# EAGLE design WeWyAn (EAGLE 9.0.1)
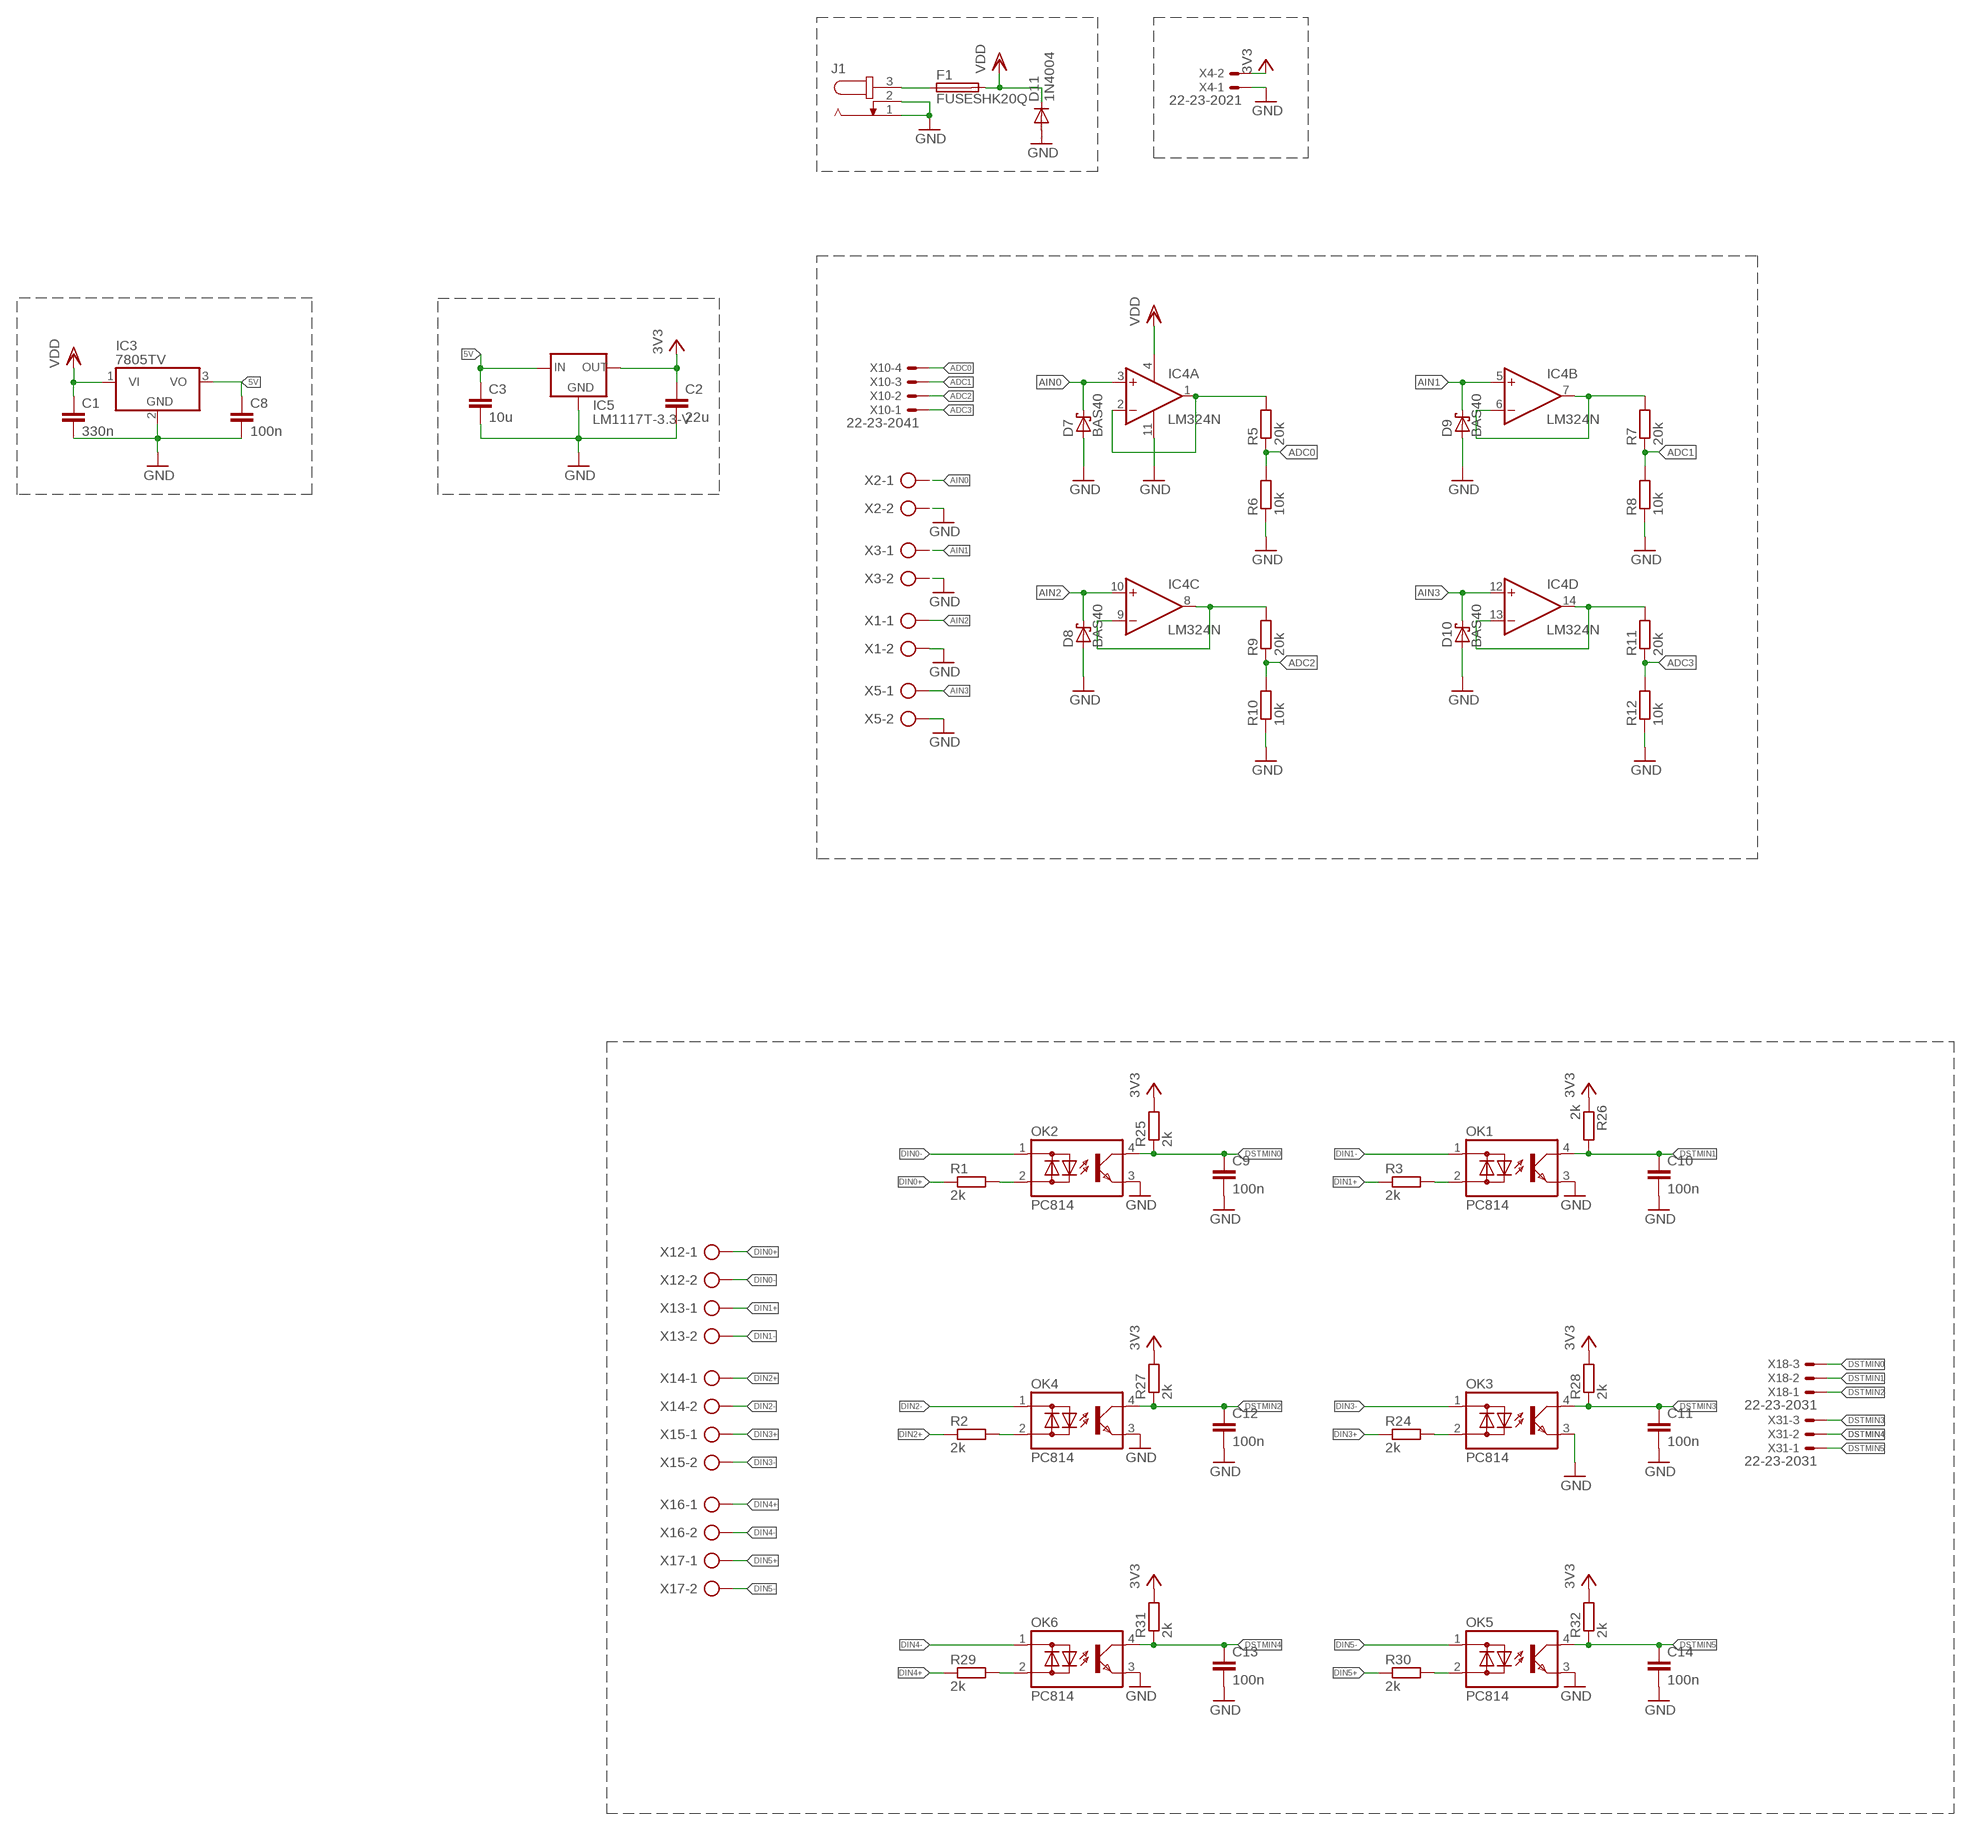
[diagram p0: schematic, sheet 1, part 1 of 2]
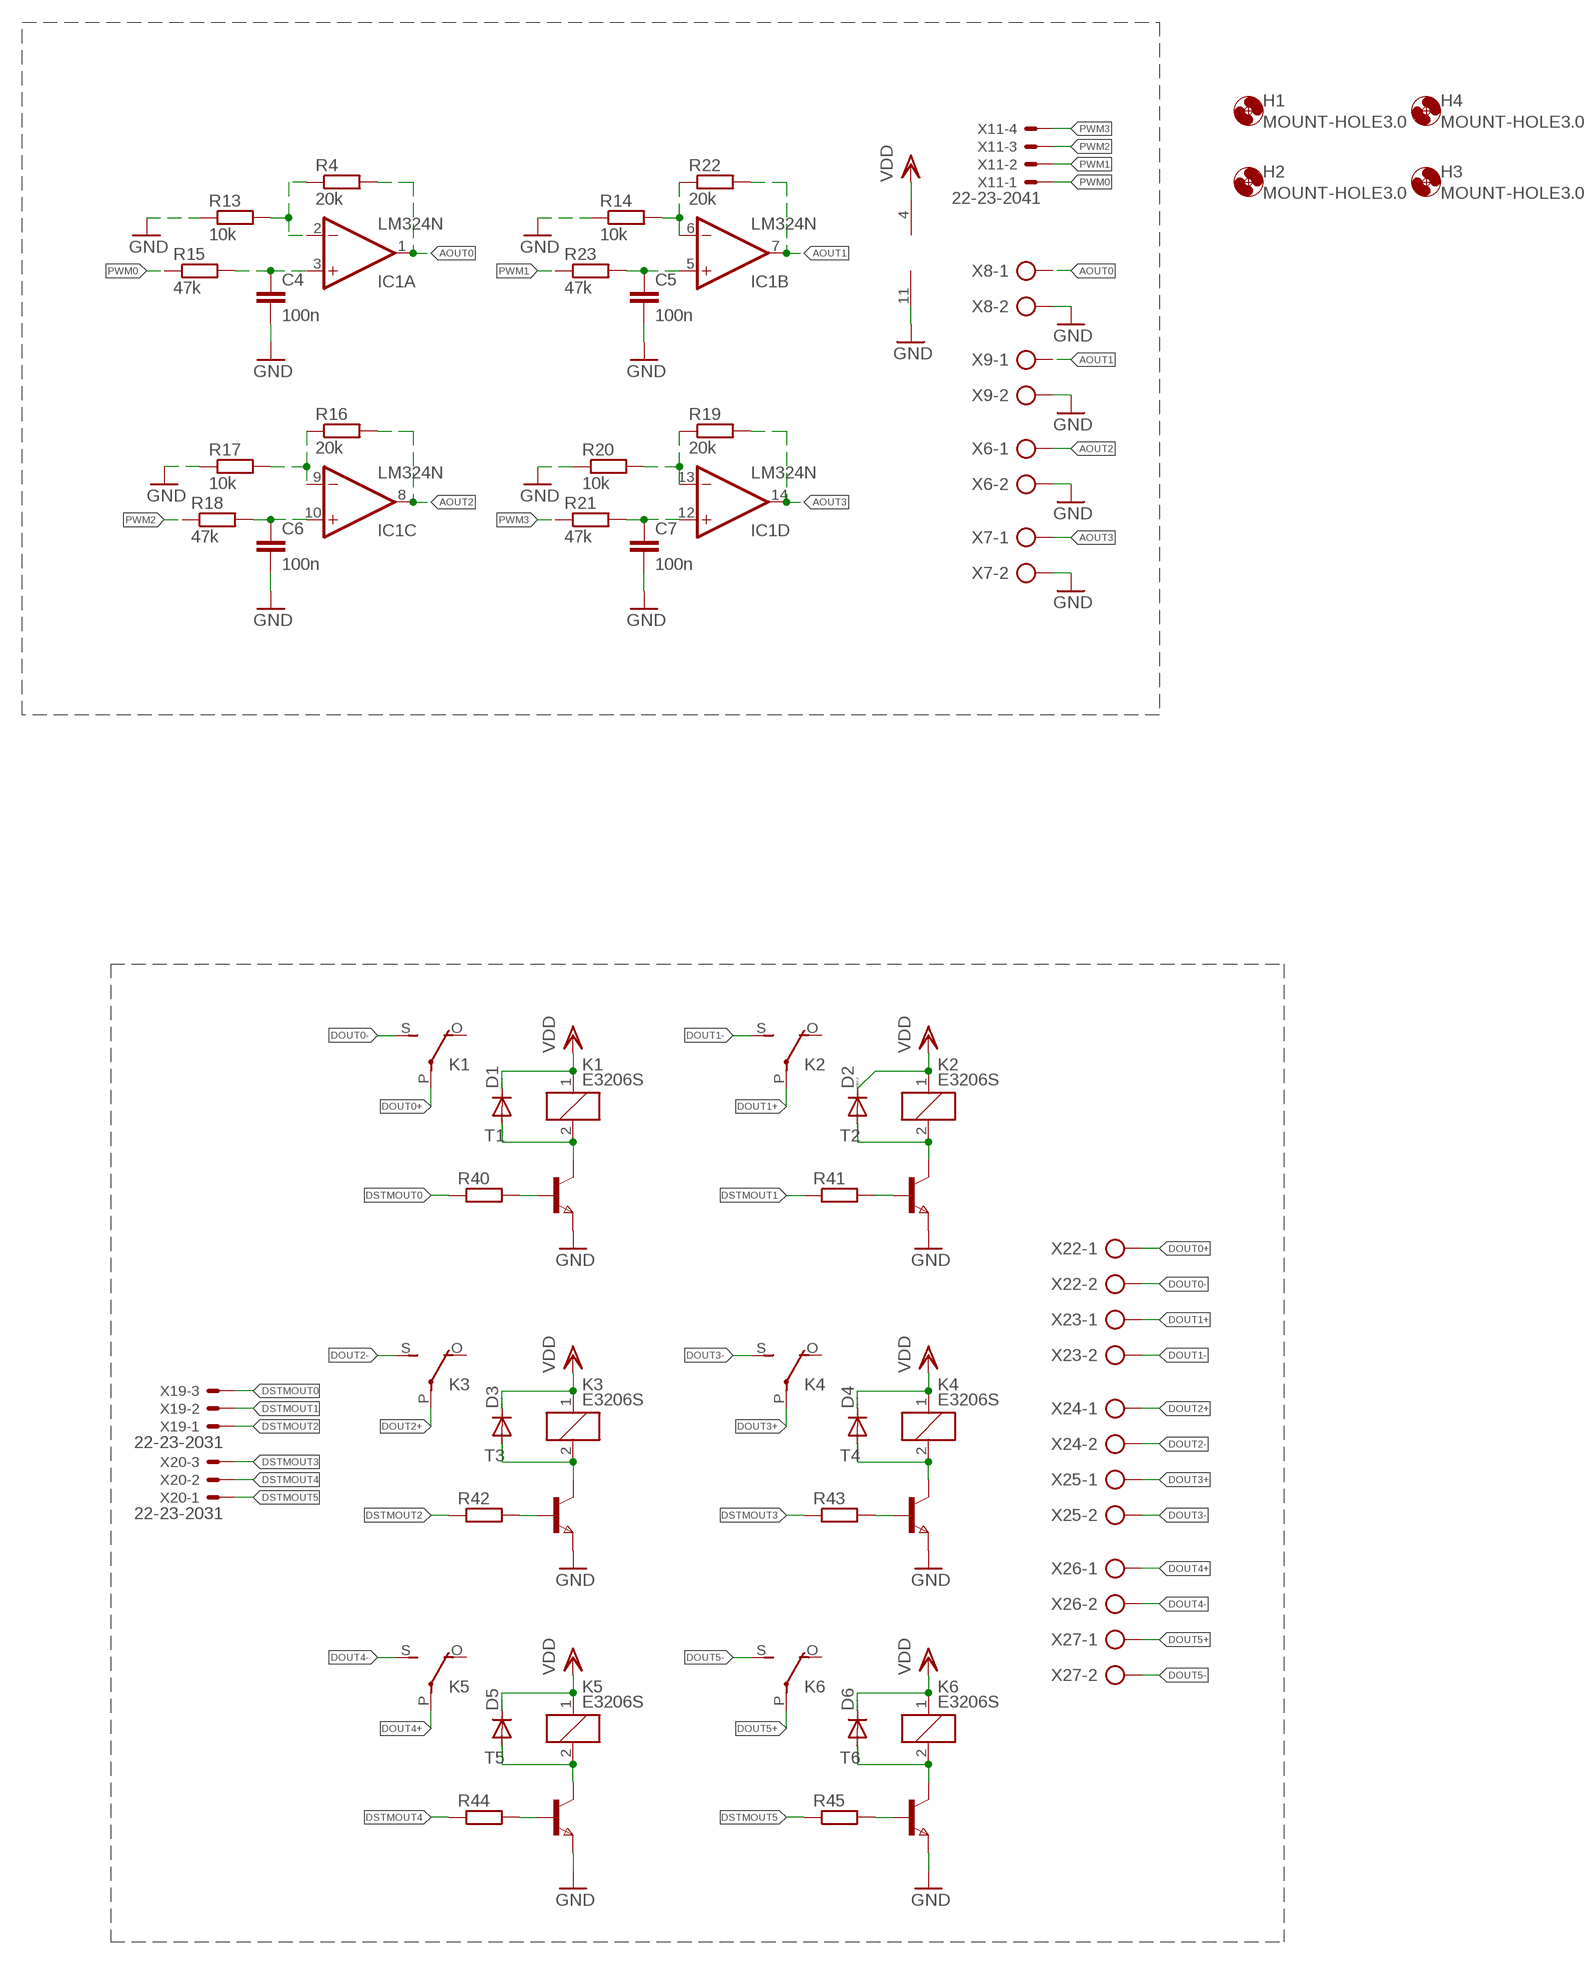
[diagram p1: schematic, sheet 1, part 2 of 2]

## Parts
C1  330n  C-EUC0603  [C0603]
C2  22u  C-EUC0603K  [C0603K]
C3  10u  C-EUC0603K  [C0603K]
C4  100n  C-EUC0603K  [C0603K]
C5  100n  C-EUC0603K  [C0603K]
C6  100n  C-EUC0603K  [C0603K]
C7  100n  C-EUC0603K  [C0603K]
C8  100n  C-EUC0603  [C0603]
C9  100n  C-EUC0603  [C0603]
C10  100n  C-EUC0603  [C0603]
C11  100n  C-EUC0603  [C0603]
C12  100n  C-EUC0603  [C0603]
C13  100n  C-EUC0603  [C0603]
C14  100n  C-EUC0603  [C0603]
D1  DIODE-DO214AC  [DO214AC]
D2  DIODE-DO214AC  [DO214AC]
D3  DIODE-DO214AC  [DO214AC]
D4  DIODE-DO214AC  [DO214AC]
D5  DIODE-DO214AC  [DO214AC]
D6  DIODE-DO214AC  [DO214AC]
D7  BAS40  [SOT23]
D8  BAS40  [SOT23]
D9  BAS40  [SOT23]
D10  BAS40  [SOT23]
D11  1N4004  [DO41-10]
F1  FUSESHK20Q  [SHK20Q]
H1  MOUNT-HOLE3.0  [3,0]
H2  MOUNT-HOLE3.0  [3,0]
H3  MOUNT-HOLE3.0  [3,0]
H4  MOUNT-HOLE3.0  [3,0]
IC1  LM324N  [DIL14]
IC3  7805TV  [TO220V]
IC4  LM324N  [DIL14]
IC5  LM1117T-3.3-V  [TO220V]
J1  JACK-PLUG1  [SPC4078]
K1  E3206S  [E3206S]
K2  E3206S  [E3206S]
K3  E3206S  [E3206S]
K4  E3206S  [E3206S]
K5  E3206S  [E3206S]
K6  E3206S  [E3206S]
OK1  PC814  [DIL04]
OK2  PC814  [DIL04]
OK3  PC814  [DIL04]
OK4  PC814  [DIL04]
OK5  PC814  [DIL04]
OK6  PC814  [DIL04]
R1  2k  R-EU_R0603  [R0603]
R2  2k  R-EU_R0603  [R0603]
R3  2k  R-EU_R0603  [R0603]
R4  20k  R-EU_R0603  [R0603]
R5  20k  R-EU_R0603  [R0603]
R6  10k  R-EU_R0603  [R0603]
R7  20k  R-EU_R0603  [R0603]
R8  10k  R-EU_R0603  [R0603]
R9  20k  R-EU_R0603  [R0603]
R10  10k  R-EU_R0603  [R0603]
R11  20k  R-EU_R0603  [R0603]
R12  10k  R-EU_R0603  [R0603]
R13  10k  R-EU_R0603  [R0603]
R14  10k  R-EU_R0603  [R0603]
R15  47k  R-EU_R0603  [R0603]
R16  20k  R-EU_R0603  [R0603]
R17  10k  R-EU_R0603  [R0603]
R18  47k  R-EU_R0603  [R0603]
R19  20k  R-EU_R0603  [R0603]
R20  10k  R-EU_R0603  [R0603]
R21  47k  R-EU_R0603  [R0603]
R22  20k  R-EU_R0603  [R0603]
R23  47k  R-EU_R0603  [R0603]
R24  2k  R-EU_R0603  [R0603]
R25  2k  R-EU_R0603  [R0603]
R26  2k  R-EU_R0603  [R0603]
R27  2k  R-EU_R0603  [R0603]
R28  2k  R-EU_R0603  [R0603]
R29  2k  R-EU_R0603  [R0603]
R30  2k  R-EU_R0603  [R0603]
R31  2k  R-EU_R0603  [R0603]
R32  2k  R-EU_R0603  [R0603]
R40  R-EU_R0603  [R0603]
R41  R-EU_R0603  [R0603]
R42  R-EU_R0603  [R0603]
R43  R-EU_R0603  [R0603]
R44  R-EU_R0603  [R0603]
R45  R-EU_R0603  [R0603]
T1  NPNSOT223  [SOT223]
T2  NPNSOT223  [SOT223]
T3  NPNSOT223  [SOT223]
T4  NPNSOT223  [SOT223]
T5  NPNSOT223  [SOT223]
T6  NPNSOT223  [SOT223]
X1  AK500/2-H  [AK500/2-H]
X2  AK500/2-H  [AK500/2-H]
X3  AK500/2-H  [AK500/2-H]
X4  22-23-2021  [22-23-2021]
X5  AK500/2-H  [AK500/2-H]
X6  AK500/2-H  [AK500/2-H]
X7  AK500/2-H  [AK500/2-H]
X8  AK500/2-H  [AK500/2-H]
X9  AK500/2-H  [AK500/2-H]
X10  22-23-2041  [22-23-2041]
X11  22-23-2041  [22-23-2041]
X12  AK500/2-H  [AK500/2-H]
X13  AK500/2-H  [AK500/2-H]
X14  AK500/2-H  [AK500/2-H]
X15  AK500/2-H  [AK500/2-H]
X16  AK500/2-H  [AK500/2-H]
X17  AK500/2-H  [AK500/2-H]
X18  22-23-2031  [22-23-2031]
X19  22-23-2031  [22-23-2031]
X20  22-23-2031  [22-23-2031]
X22  AK500/2-H  [AK500/2-H]
X23  AK500/2-H  [AK500/2-H]
X24  AK500/2-H  [AK500/2-H]
X25  AK500/2-H  [AK500/2-H]
X26  AK500/2-H  [AK500/2-H]
X27  AK500/2-H  [AK500/2-H]
X31  22-23-2031  [22-23-2031]

## Nets
5V: C3.1 C8.1 IC3.3(VO) IC5.3(IN)
ADC0: R5.1 R6.2 X10.4
ADC1: R7.1 R8.2 X10.3
ADC2: R9.1 R10.2 X10.2
ADC3: R11.1 R12.2 X10.1
AIN0: D7.3(C) IC4.3(A:+IN) X2.1
AIN1: D9.3(C) IC4.5(B:+IN) X3.1
AIN2: D8.3(C) IC4.10(C:+IN) X1.1
AIN3: D10.3(C) IC4.12(D:+IN) X5.1
AOUT0: IC1.1(A:OUT) R4.2 X8.1
AOUT1: IC1.7(B:OUT) R22.2 X9.1
AOUT2: IC1.8(C:OUT) R16.2 X6.1
AOUT3: IC1.14(D:OUT) R19.2 X7.1
DIN0+: R1.1 X12.1
DIN0-: OK2.1(AC1) X12.2
DIN1+: R3.1 X13.1
DIN1-: OK1.1(AC1) X13.2
DIN2+: R2.1 X14.1
DIN2-: OK4.1(AC1) X14.2
DIN3+: R24.1 X15.1
DIN3-: OK3.1(AC1) X15.2
DIN4+: R29.1 X16.1
DIN4-: OK6.1(AC1) X16.2
DIN5+: R30.1 X17.1
DIN5-: OK5.1(AC1) X17.2
DOUT0+: K1.P(2:P) X22.1
DOUT0-: K1.S(2:S) X22.2
DOUT1+: K2.P(2:P) X23.1
DOUT1-: K2.S(2:S) X23.2
DOUT2+: K3.P(2:P) X24.1
DOUT2-: K3.S(2:S) X24.2
DOUT3+: K4.P(2:P) X25.1
DOUT3-: K4.S(2:S) X25.2
DOUT4+: K5.P(2:P) X26.1
DOUT4-: K5.S(2:S) X26.2
DOUT5+: K6.P(2:P) X27.1
DOUT5-: K6.S(2:S) X27.2
DSTMIN0: C9.1 OK2.4(C) R25.1 X18.3
DSTMIN1: C10.1 OK1.4(C) R26.2 X18.2
DSTMIN2: C12.1 OK4.4(C) R27.1 X18.1
DSTMIN3: C11.1 OK3.4(C) R28.1 X31.3
DSTMIN4: C13.1 OK6.4(C) R31.1 X31.2
DSTMIN5: C14.1 OK5.4(C) R32.1 X31.1
DSTMOUT0: R40.1 X19.3
DSTMOUT1: R41.1 X19.2
DSTMOUT2: R42.1 X19.1
DSTMOUT3: R43.1 X20.3
DSTMOUT4: R44.1 X20.2
DSTMOUT5: R45.1 X20.1
GND: C1.2 C2.2 C3.2 C4.2 C5.2 C6.2 C7.2 C8.2 C9.2 C10.2 C11.2 C12.2 C13.2 C14.2 D7.1(A) D8.1(A) D9.1(A) D10.1(A) D11.A IC1.11(P:V-) IC3.2(GND) IC4.11(P:V-) IC5.1(GND) J1.1 J1.2 OK1.3(E) OK2.3(E) OK3.3(E) OK4.3(E) OK5.3(E) OK6.3(E) R6.1 R8.1 R10.1 R12.1 R13.1 R14.1 R17.1 R20.1 T1.3(E) T2.3(E) T3.3(E) T4.3(E) T5.3(E) T6.3(E) X1.2 X2.2 X3.2 X4.1 X5.2 X6.2 X7.2 X8.2 X9.2
MINUS0: IC4.1(A:OUT) IC4.2(A:-IN) R5.2
MINUS1: IC4.6(B:-IN) IC4.7(B:OUT) R7.2
MINUS2: IC4.8(C:OUT) IC4.9(C:-IN) R9.2
MINUS3: IC4.13(D:-IN) IC4.14(D:OUT) R11.2
N$1: IC1.2(A:-IN) R4.1 R13.2
N$2: OK2.2(AC2) R1.2
N$3: C4.1 IC1.3(A:+IN) R15.2
N$4: C6.1 IC1.10(C:+IN) R18.2
N$5: OK1.2(AC2) R3.2
N$6: IC1.9(C:-IN) R16.1 R17.2
N$7: IC1.13(D:-IN) R19.1 R20.2
N$8: IC1.6(B:-IN) R14.2 R22.1
N$9: OK3.2(AC2) R24.2
N$10: OK4.2(AC2) R2.2
N$11: C7.1 IC1.12(D:+IN) R21.2
N$12: F1.1A J1.3
N$15: C5.1 IC1.5(B:+IN) R23.2
N$17: OK5.2(AC2) R30.2
N$18: OK6.2(AC2) R29.2
N$21: R40.2 T1.1(B)
N$22: D1.A K1.2 T1.2(C) T1.4(C)
N$23: R41.2 T2.1(B)
N$24: R43.2 T4.1(B)
N$25: D2.A K2.2 T2.2(C) T2.4(C)
N$26: R42.2 T3.1(B)
N$27: D3.A K3.2 T3.2(C) T3.4(C)
N$28: R44.2 T5.1(B)
N$29: D4.A K4.2 T4.2(C) T4.4(C)
N$30: R45.2 T6.1(B)
N$31: D5.A K5.2 T5.2(C) T5.4(C)
N$32: D6.A K6.2 T6.2(C) T6.4(C)
PWM0: R15.1 X11.1
PWM1: R23.1 X11.2
PWM2: R18.1 X11.3
PWM3: R21.1 X11.4
VCC: C2.1 IC5.2(OUT) R25.2 R26.1 R27.2 R28.2 R31.2 R32.2 X4.2 ; supply symbol labelled 3V3
VDD: C1.1 D1.C D2.C D3.C D4.C D5.C D6.C D11.C F1.2A IC1.4(P:V+) IC3.1(VI) IC4.4(P:V+) K1.1 K2.1 K3.1 K4.1 K5.1 K6.1
Unconnected: K1.O(2:O) K2.O(2:O) K3.O(2:O) K4.O(2:O) K5.O(2:O) K6.O(2:O)

## Library data of the parts
C1 C8-C14 = rcl:C-EU: CAPACITOR, European symbol; SPICEPREFIX: C
C2-C7 = rcl:C-EU: CAPACITOR, European symbol
D1-D6 = diode:DIODE-: DIODE
D7-D10 = diode:BAS40: Silicon Schottky Diodes General-purpose diode for high-speed switching
D11 = diode:1N4004: DIODE general purpose rectifier, 1 A
F1 = fuse:FUSE: Fuse; OC_FARNELL: unknown; OC_NEWARK: unknown
H1-H4 = holes:MOUNT-HOLE: MOUNTING HOLE with drill center marker
IC1 IC4 = linear:LM324: OP AMP
IC3 = linear:78*: Positive VOLTAGE REGULATOR Source: http://cache.national.com/ds/LM/LM78L05.pdf http://www.fairchildsemi.com/ds/LM/LM7805.pdf
IC5 = lm1117:LM1117T-*
J1 = con-jack:JACK-PLUG: DC POWER JACK Power Jack, DC, Right Angle, Through Hole, Rated 5A at 16VDC, PC Terminals Distributor: Farnell (www.Farnell.de) Drawing: 84N1161.pdf / 84N1162.pdf Manufacturer: SPC Technology (www.spctechnology.com) Type: SPC4077 / SPC 4078; OC_FARNELL: unknown; OC_NEWARK: unknown
K1-K6 = relay:E3206S: RELAY 1 x switch, Eichhoff/distributor Schukat; OC_FARNELL: unknown; OC_NEWARK: unknown
OK1-OK6 = optocoupler:PC814: SHARP OPTO COUPLER; OC_FARNELL: 9707662; OC_NEWARK: unknown
R1-R32 = rcl:R-EU_: RESISTOR, European symbol
R40-R45 = rcl:R-EU_: RESISTOR, European symbol; SPICEPREFIX: R
T1-T6 = zetex:NPNSOT223: NPN TRANSISTOR; MPN: DJT4031N-13; OC_FARNELL: 1710672; OC_NEWARK: 25R4490
X1-X3 X5-X9 X12-X17 X22-X27 = con-ptr500:AK500/2-H: CONNECTOR Aug. 2004 / PTR Meßtechnik: Die Bezeichnung der Serie AK505 wurde geändert. Es handelt sich hierbei um AK500 in horizontaler Ausführung.; OC_FARNELL: unknown; OC_NEWARK: unknown
X4 = con-molex:22-23-2021: .100" (2.54mm) Center Header - 2 Pin; MF: MOLEX; MPN: 22-23-2021; OC_FARNELL: 1462926; OC_NEWARK: 25C3832
X10 X11 = con-molex:22-23-2041: .100" (2.54mm) Center Header - 4 Pin; MF: MOLEX; MPN: 22-23-2041; OC_FARNELL: 1462920; OC_NEWARK: 38C0355
X18-X20 X31 = con-molex:22-23-2031: .100" (2.54mm) Center Header - 3 Pin; MF: MOLEX; MPN: 22-23-2031; OC_FARNELL: 1462950; OC_NEWARK: 30C0862

## Board
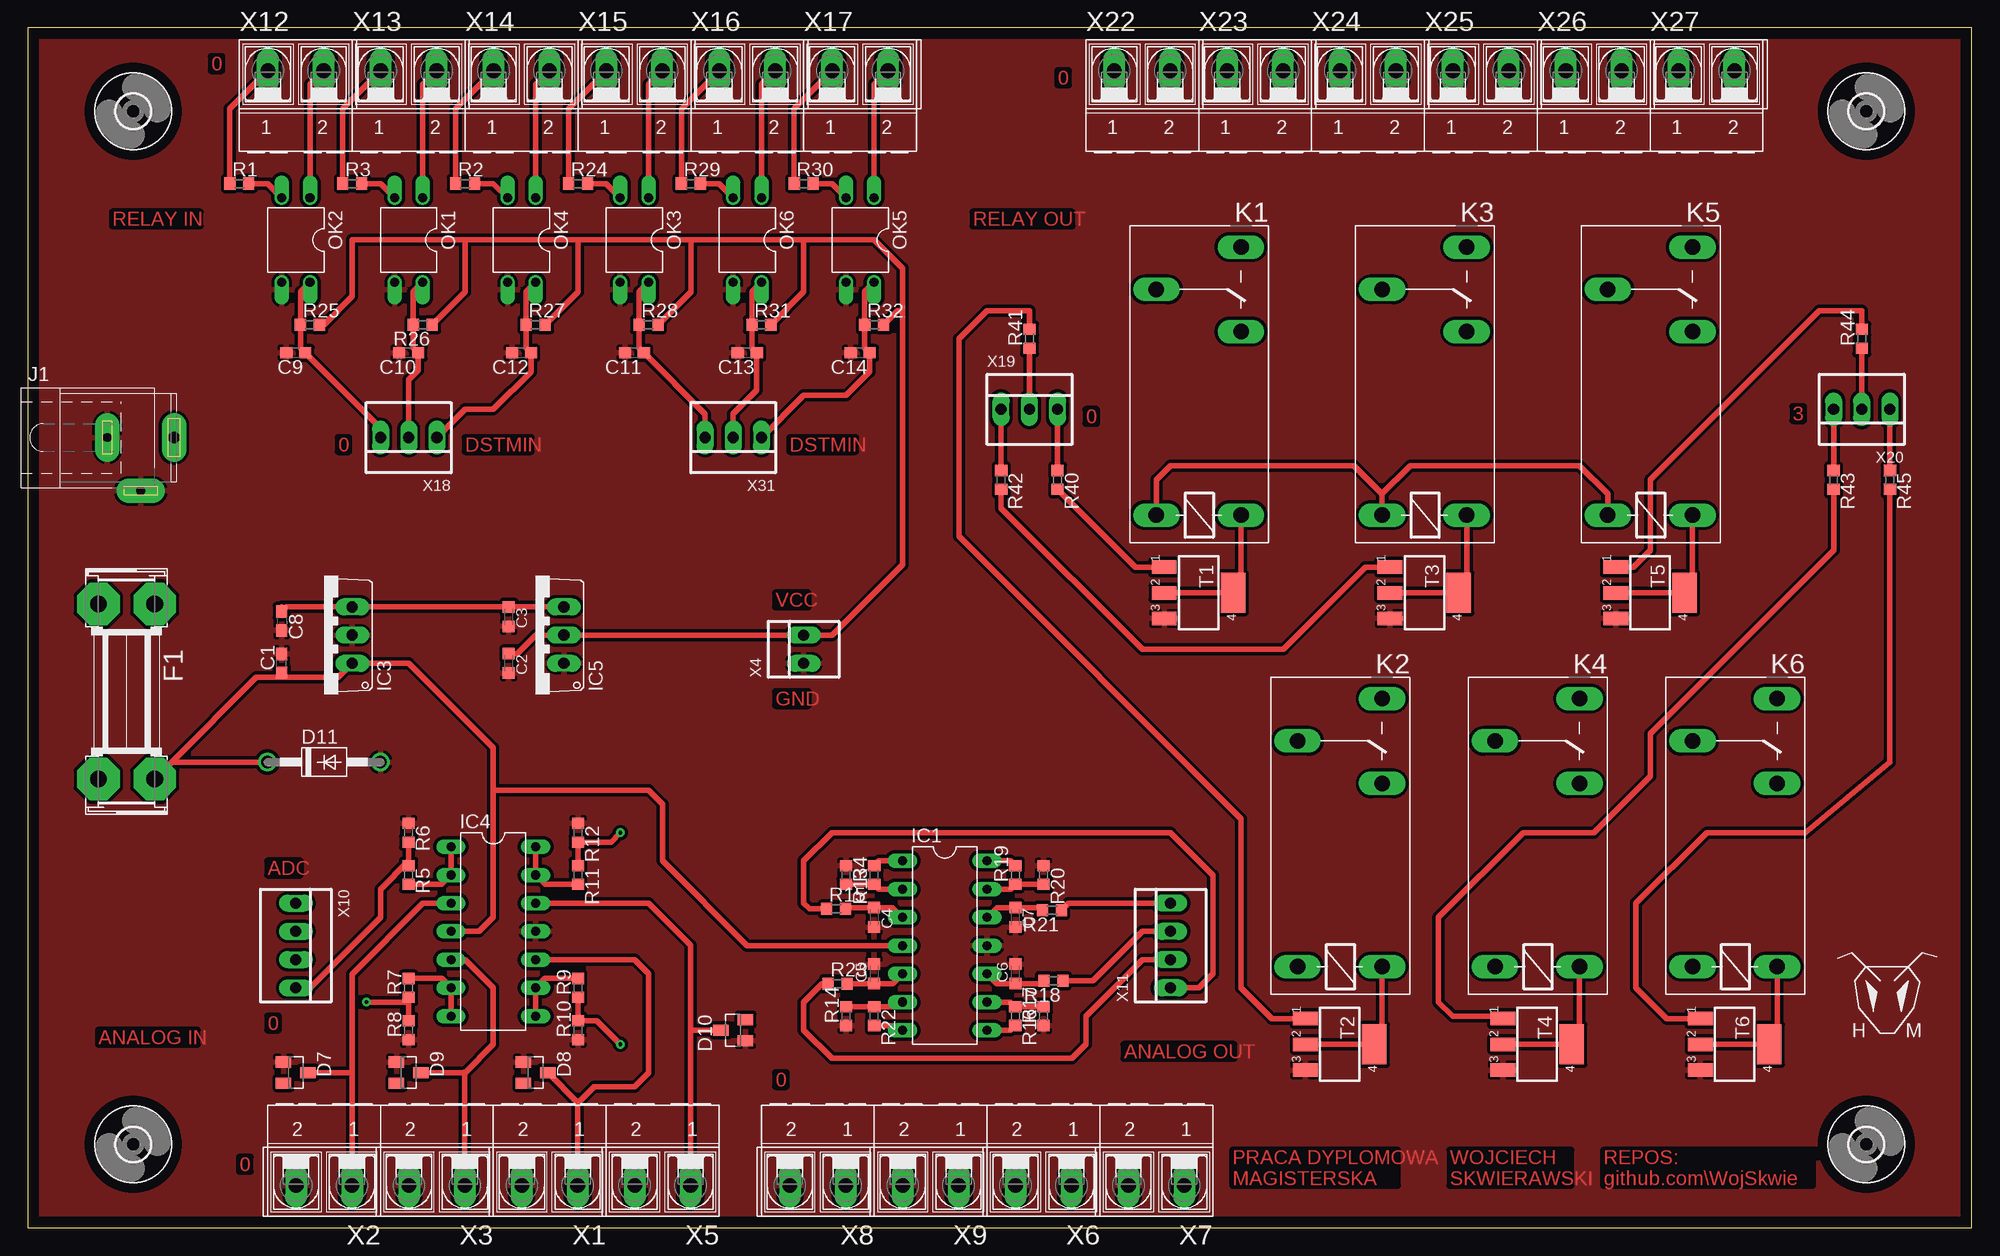
[diagram p2: board, top side]
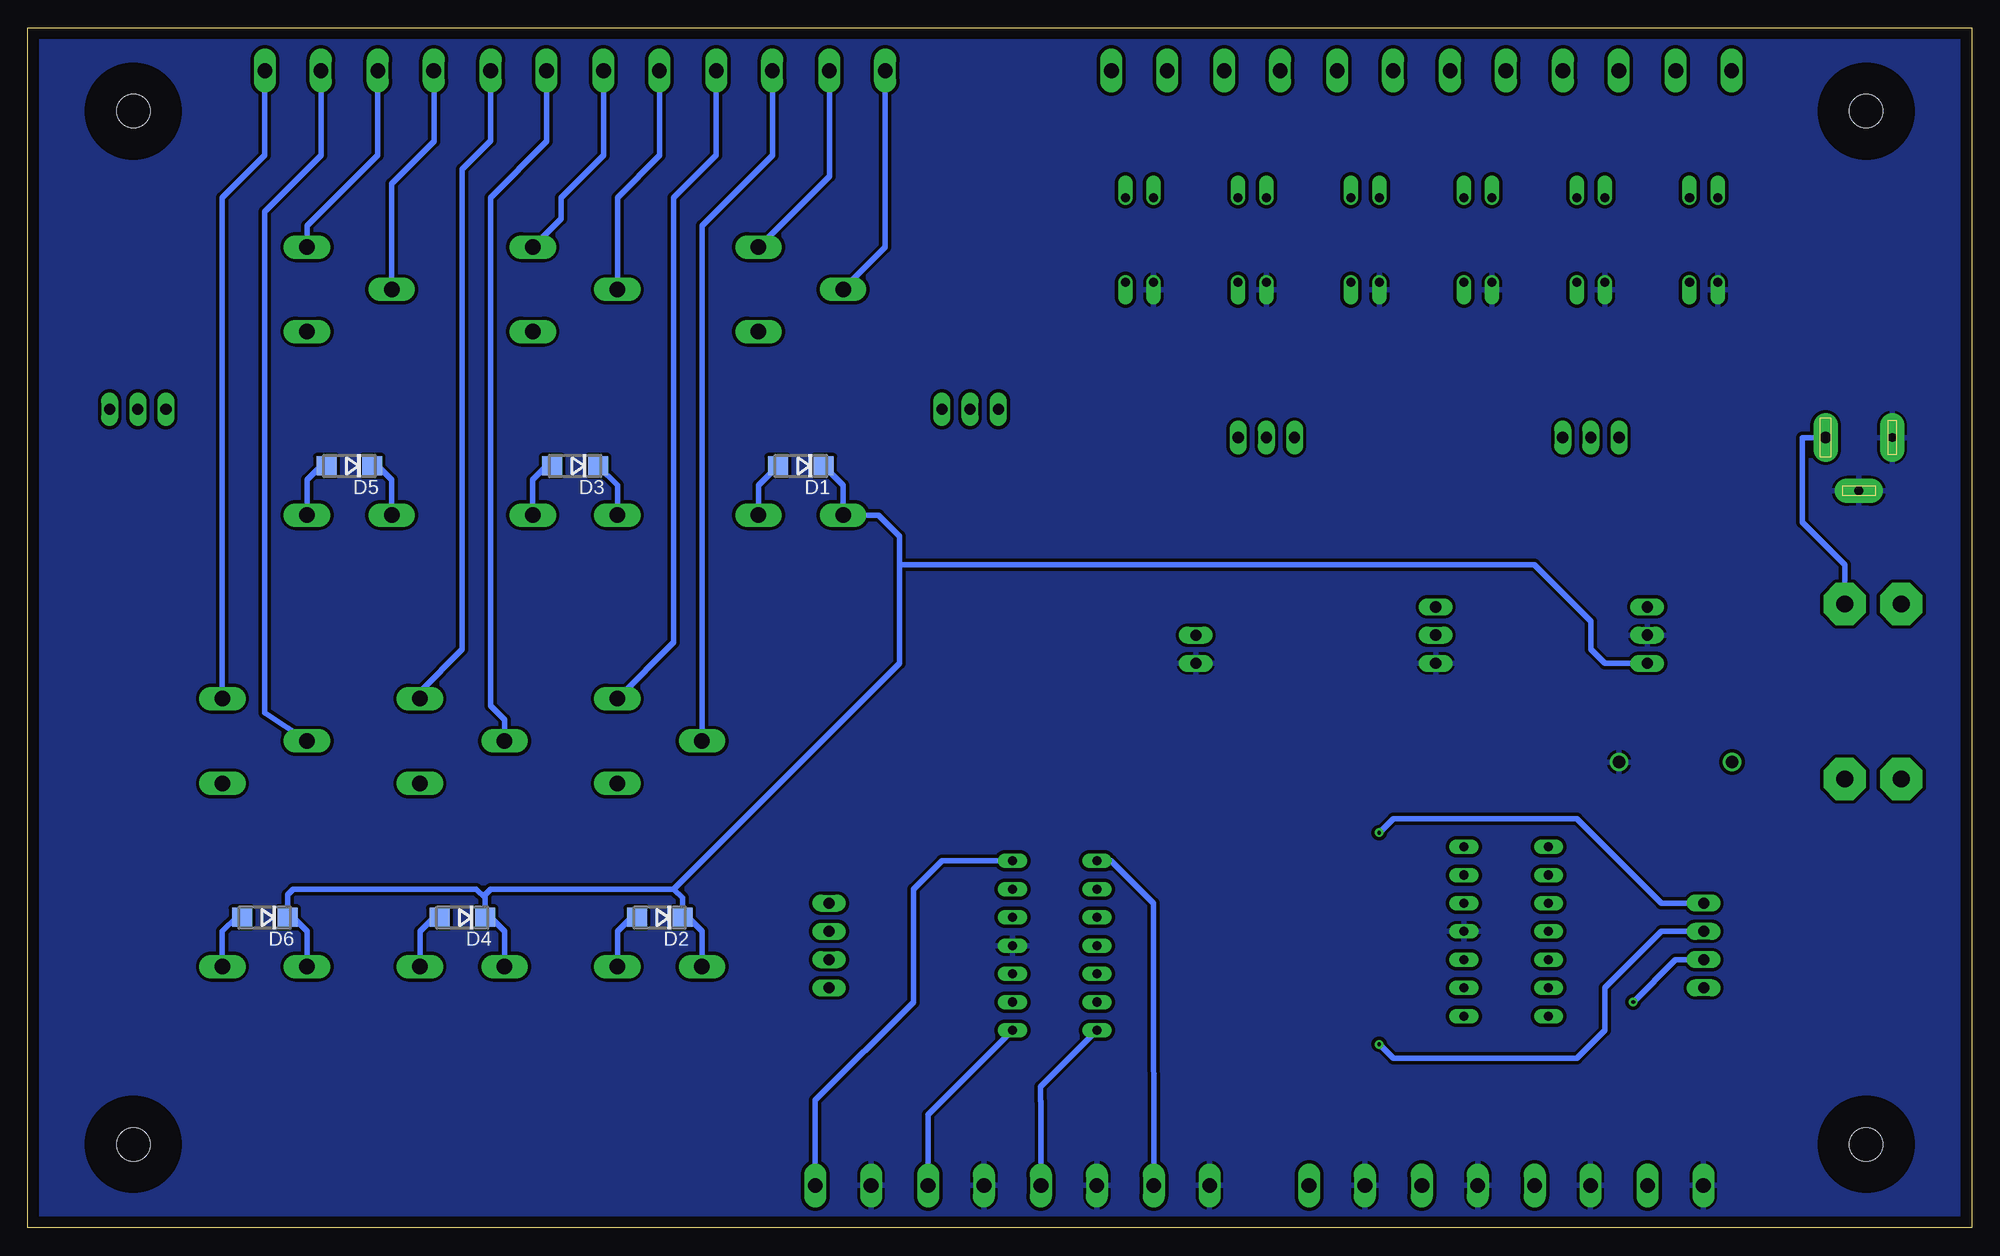
[diagram p3: board, bottom side, seen from below]

Size 175 x 108 mm. Coordinates in mm from the lower left corner, seen from the top.
Outline: 0,0 175,0 175,108 0,108 0,0
Copper layers (1*16): Top 0.035mm / dielectric 1.5mm / Bottom 0.035mm
Design rules "default": minimum track width 6mil, minimum drill 0.35mm, track to track 6mil, track to pad 6mil, pad to pad 6mil, via to via 6mil, smd to smd 6mil, copper to edge 40mil, drill to drill 6mil, minimum pad ring 10mil, minimum via ring 8mil, stop-mask expansion 4mil, vias tented up to drill 0mil, thermal gap 10mil

### Footprints (pad centres in the part's own frame; a part is rotated, then mirrored left to right if it is on the bottom)
C0603 = smd 1.1 x 1: 1 -0.85,0; 2 0.85,0
C0603K = smd 1.05 x 1.08: 1 -0.875,0; 2 0.875,0
DO214AC = smd 1.8 x 1.7: A 2.05,0; C -2.05,0
SOT23 = smd 1 x 1.4: 1 -0.95,-1.1; 2 0.95,-1.1; 3 0,1.1
DO41-10 = drill 1.118: A 5.08,0; C -5.08,0
SHK20Q = drill 1.5 pad 3.81 octagon: 1A -7.874,2.54; 1B -7.874,-2.54; 2A 7.874,2.54; 2B 7.874,-2.54
3,0 = hole 3: 0,0
DIL14 = drill 0.813 long: 1 -7.62,-3.81; 2 -5.08,-3.81; 3 -2.54,-3.81; 4 0,-3.81; 5 2.54,-3.81; 6 5.08,-3.81; 7 7.62,-3.81; 8 7.62,3.81; 9 5.08,3.81; 10 2.54,3.81; 11 0,3.81; 12 -2.54,3.81; 13 -5.08,3.81; 14 -7.62,3.81
TO220V = drill 1.016 long: 1 -2.54,-2.54; 2 0,-2.54; 3 2.54,-2.54
SPC4078 = drill 0.8 pad 2.184 long: 1 -3,0; 2 0,-4.8 | drill 1 pad 2.184 long: 3 3,0
E3206S = drill 1.397 long: 1 -3.175,3.81; 2 -3.175,-3.81; O 13.335,-3.81; P 17.145,3.81; S 20.955,-3.81
DIL04 = drill 0.813 offset: 1 -1.27,-3.81; 2 1.27,-3.81; 3 1.27,3.81; 4 -1.27,3.81
R0603 = smd 1 x 1.1: 1 -0.85,0; 2 0.85,0
SOT223 = smd 1.219 x 2.235: 1 -2.311,-3.099; 2 0,-3.099; 3 2.311,-3.099 | smd 3.6 x 2.2: 4 0,3.099
AK500/2-H = drill 1.321 long: 1 -2.515,0; 2 2.515,0
22-23-2021 = drill 1 long: 1 -1.27,0; 2 1.27,0
22-23-2041 = drill 1 long: 1 -3.81,0; 2 -1.27,0; 3 1.27,0; 4 3.81,0
22-23-2031 = drill 1 long: 1 -2.54,0; 2 0,0; 3 2.54,0

### Placement (x,y rotation side)
C1  22.86,50.8 90 top
C2  43.31,50.8 270 top
C3  43.31,54.99 270 top
C4  76.2,27.94 270 top
C5  76.2,22.86 90 top
C6  88.9,22.86 90 top
C7  88.9,27.94 270 top
C8  22.86,54.61 270 top
C9  24.13,78.74 180 top
C10  34.29,78.74 180 top
C11  54.61,78.74 180 top
C12  44.45,78.74 180 top
C13  64.77,78.74 180 top
C14  74.93,78.74 180 top
D1  105.41,68.58 180 bottom
D2  118.11,27.94 180 bottom
D3  125.73,68.58 180 bottom
D4  135.89,27.94 180 bottom
D5  146.05,68.58 180 bottom
D6  153.67,27.94 180 bottom
D7  24.13,13.97 270 top
D8  45.72,13.97 270 top
D9  34.29,13.97 270 top
D10  63.5,17.78 90 top
D11  26.67,41.91 0 top
F1  8.89,48.26 270 top
H1  165.5,7.5 0 top
H2  9.5,7.5 0 top
H3  165.5,100.5 0 top
H4  9.5,100.5 0 top
IC1  82.55,25.4 270 top
IC3  26.67,53.34 90 top
IC4  41.91,26.67 270 top
IC5  45.72,53.34 90 top
J1  10.16,71.12 0 top
K1  105.41,67.31 90 top
K2  118.11,26.67 90 top
K3  125.73,67.31 90 top
K4  135.89,26.67 90 top
K5  146.05,67.31 90 top
K6  153.67,26.67 90 top
OK1  34.29,88.9 180 top
OK2  24.13,88.9 180 top
OK3  54.61,88.9 180 top
OK4  44.45,88.9 180 top
OK5  74.93,88.9 180 top
OK6  64.77,88.9 180 top
R1  19.05,93.98 0 top
R2  39.37,93.98 0 top
R3  29.21,93.98 0 top
R4  76.2,31.75 90 top
R5  34.29,31.75 270 top
R6  34.29,35.56 270 top
R7  34.29,21.59 90 top
R8  34.29,17.78 90 top
R9  49.53,21.59 90 top
R10  49.53,17.78 90 top
R11  49.53,31.75 270 top
R12  49.53,35.56 270 top
R13  73.66,31.75 270 top
R14  73.66,19.05 90 top
R15  72.77,28.7 0 top
R16  88.9,19.05 270 top
R17  91.44,19.05 90 top
R18  92.33,22.23 180 top
R19  88.9,31.75 90 top
R20  91.44,31.75 270 top
R21  92.2,28.57 180 top
R22  76.2,19.05 270 top
R23  72.9,21.97 0 top
R24  49.53,93.98 0 top
R25  25.4,81.28 0 top
R26  35.56,81.28 180 top
R27  45.72,81.28 0 top
R28  55.88,81.28 0 top
R29  59.69,93.98 0 top
R30  69.85,93.98 0 top
R31  66.04,81.28 0 top
R32  76.2,81.28 0 top
R40  92.71,67.31 270 top
R41  90.17,80.01 90 top
R42  87.63,67.31 270 top
R43  162.56,67.31 270 top
R44  165.1,80.01 90 top
R45  167.64,67.31 270 top
T1  105.41,57.15 270 top
T2  118.11,16.51 270 top
T3  125.73,57.15 270 top
T4  135.89,16.51 270 top
T5  146.05,57.15 270 top
T6  153.67,16.51 270 top
X1  46.99,3.81 180 top
X2  26.67,3.81 180 top
X3  36.83,3.81 180 top
X4  69.85,52.07 90 top
X5  57.15,3.81 180 top
X6  91.44,3.81 180 top
X7  101.6,3.81 180 top
X8  71.12,3.81 180 top
X9  81.28,3.81 180 top
X10  24.13,25.4 270 top
X11  102.87,25.4 90 top
X12  24.13,104.14 0 top
X13  34.29,104.14 0 top
X14  44.45,104.14 0 top
X15  54.61,104.14 0 top
X16  64.77,104.14 0 top
X17  74.93,104.14 0 top
X18  34.29,71.12 180 top
X19  90.17,73.66 0 top
X20  165.1,73.66 180 top
X22  100.33,104.14 0 top
X23  110.49,104.14 0 top
X24  120.65,104.14 0 top
X25  130.81,104.14 0 top
X26  140.97,104.14 0 top
X27  151.13,104.14 0 top
X31  63.5,71.12 180 top

### Tracks (layer width: path | path; a pad name or v marks a point on that pad's centre or on a via)
5V
  Top 0.508: 22.86,55.88 C8.1 23.28,55.88 IC3.3 | IC3.3 29.22,55.87 | IC5.3 C3.1 43.29,55.88 IC3.3
ADC0
  Top 0.508: R5.1 34.29,33.02 | 34.29,33.02 R6.2 | X10.4 25.4,21.59 31.75,27.94 31.75,30.48 34.29,33.02
ADC1  (via drill 0.35)
  Top 0.508: R7.1 34.29,20.32 | 34.29,20.32 R8.2 | v30.48,20.32 34.29,20.32
  Bottom 0.508: X10.3 26.67,24.13 v30.48,20.32
ADC2  (via drill 0.35)
  Top 0.508: R9.1 R10.2 51.22,18.63 v53.34,16.51
  Bottom 0.508: X10.2 27.94,26.67 33.02,21.59 33.02,17.78 35.56,15.24 52.07,15.24 v53.34,16.51
ADC3  (via drill 0.35)
  Top 0.508: R11.1 R12.2 52.49,34.71 v53.34,35.56
  Bottom 0.508: X10.1 27.94,29.21 35.56,36.83 52.07,36.83 v53.34,35.56
AIN0
  Top 0.508: X2.1 29.18,13.97 | 29.18,13.97 29.18,22.84 35.56,29.21 IC4.3 | 29.16,13.99 29.18,13.97 | D7.3 29.18,13.97
AIN1
  Top 0.508: X3.1 39.34,13.95 | IC4.5 39.37,24.13 41.91,21.59 41.91,16.51 39.37,13.97 | 39.34,13.95 39.37,13.97 | 39.29,13.99 39.34,13.95 | D9.3 39.37,13.97
AIN2
  Top 0.508: X1.1 49.52,3.82 49.52,11.21 | IC4.10 54.61,24.13 55.88,22.86 55.88,13.97 54.61,12.7 51,12.7 49.52,11.21 | D8.3 49.52,11.27 49.52,11.21
AIN3
  Top 0.508: X5.1 59.66,17.78 | 59.66,17.78 59.66,25.43 55.88,29.21 IC4.12 | D10.3 59.66,17.78
AOUT0
  Top 0.508: R4.2 76.62,33.02 IC1.1
  Bottom 0.508: X8.1 73.64,11.46 73.66,16.51 73.66,29.21 77.47,33.02 IC1.1
AOUT1
  Top 0.508: R22.2 78.32,18.2 IC1.7
  Bottom 0.508: X9.1 83.8,11.4 83.82,11.43 83.82,12.7 IC1.7
AOUT2
  Top 0.508: IC1.8 88.48,17.78 R16.2
  Bottom 0.508: X6.1 93.95,10.19 IC1.8
AOUT3
  Top 0.508: IC1.14 88.48,33.02 R19.2
  Bottom 0.508: X7.1 104.11,11.46 95.25,20.32 95.25,30.48 92.71,33.02 IC1.14
DIN0+
  Top 0.508: R1.1 18.2,100.72 X12.1
DIN0-
  Top 0.508: OK2.1 25.4,102.89 X12.2
DIN1+
  Top 0.508: R3.1 28.36,100.72 X13.1
DIN1-
  Top 0.508: OK1.1 35.56,102.89 X13.2
DIN2+
  Top 0.508: R2.1 38.52,100.72 X14.1
DIN2-
  Top 0.508: OK4.1 45.72,102.89 X14.2
DIN3+
  Top 0.508: R24.1 48.68,100.72 X15.1
DIN3-
  Top 0.508: OK3.1 55.88,102.89 X15.2
DIN4+
  Top 0.508: R29.1 58.84,100.72 X16.1
DIN4-
  Top 0.508: OK6.1 66.04,102.89 X16.2
DIN5+
  Top 0.508: R30.1 69,100.72 X17.1
DIN5-
  Top 0.508: OK5.1 76.2,102.89 X17.2
DOUT0+
  Bottom 0.508: K1.P 97.81,88.24 X22.1
DOUT0-
  Bottom 0.508: K1.S 102.84,94.64 X22.2
DOUT1+
  Bottom 0.508: K2.P 114.3,90.17 107.95,96.52 107.95,102.87 107.97,102.89 X23.1
DOUT1-
  Bottom 0.508: K2.S 116.84,52.7 116.84,92.71 113.03,96.52 113.03,104.11 X23.2
DOUT2+
  Bottom 0.508: K3.P 121.92,92.71 118.11,96.52 118.11,104.11 X24.1
DOUT2-
  Bottom 0.508: K3.S 127,90.81 127,92.71 123.17,96.55 X24.2
DOUT3+
  Bottom 0.508: K4.P 132.08,45.72 133.35,46.99 133.35,92.71 128.27,97.79 128.27,104.11 X25.1
DOUT3-
  Bottom 0.508: K4.S 139.7,48.26 135.89,52.07 135.89,95.25 133.32,97.81 X25.2
DOUT4+
  Bottom 0.508: X26.1 138.43,104.11 138.43,97.79 142.24,93.98 K5.P
DOUT4-
  Bottom 0.508: K5.S 149.86,90.17 143.49,96.55 X26.2
DOUT5+
  Bottom 0.508: K6.P 153.67,46.35 153.67,91.44 148.59,96.52 148.59,104.11 X27.1
DOUT5-
  Bottom 0.508: K6.S 157.48,92.71 153.67,96.52 153.67,104.11 X27.2
DSTMIN0
  Top 0.508: OK2.4 24.55,84.24 R25.1 24.55,79.17 C9.1 31.75,71.97 X18.3
DSTMIN1
  Top 0.508: OK1.4 34.71,84.24 R26.2 34.71,79.17 C10.1 35.14,77.18 34.29,76.33 X18.2
DSTMIN2
  Top 0.508: OK4.4 44.87,84.24 R27.1 44.87,79.17 C12.1 45.3,77.05 41.91,73.66 39.37,73.66 X18.1
DSTMIN3
  Top 0.508: OK3.4 55.03,84.24 R28.1 55.03,79.17 C11.1 60.96,73.24 X31.3
DSTMIN4
  Top 0.508: OK6.4 65.19,84.24 R31.1 65.19,79.17 C13.1 65.62,75.4 63.5,73.28 X31.2
DSTMIN5
  Top 0.508: OK5.4 75.35,84.24 R32.1 75.35,79.17 C14.1 75.78,77.05 73.66,74.93 69.85,74.93 X31.1
DSTMOUT0
  Top 0.508: X19.3 R40.1
DSTMOUT1
  Top 0.508: X19.2 R41.1
DSTMOUT2
  Top 0.508: X19.1 R42.1
DSTMOUT3
  Top 0.508: X20.3 R43.1
DSTMOUT4
  Top 0.508: X20.2 R44.1
DSTMOUT5
  Top 0.508: X20.1 R45.1
GND
  pour Top (isolate 0.305): 0,110 0,0 220,0 220,110
  pour Bottom (isolate 0.305): 0,110 220,110 220,0 0,0
MINUS0
  Top 0.508: IC4.1 IC4.2 37.25,30.9 R5.2
MINUS1
  Top 0.508: IC4.7 IC4.6 37.25,22.44 R7.2
MINUS2
  Top 0.508: IC4.8 IC4.9 46.57,22.44 R9.2
MINUS3
  Top 0.508: IC4.14 IC4.13 46.57,30.9 R11.2
N$1
  Top 0.508: IC1.2 76.62,30.48 R4.1 R13.2
N$2
  Top 0.508: R1.2 21.59,93.98 OK2.2
N$3
  Top 0.508: IC1.3 77.86,28.82 C4.1 76.17,28.79 73.71,28.79 R15.2
N$4
  Top 0.508: IC1.10 87.23,21.98 C6.1 91.24,21.98 R18.2
N$5
  Top 0.508: R3.2 31.75,93.98 OK1.2
N$6
  Top 0.508: IC1.9 88.48,20.32 R16.1 R17.2
N$7
  Top 0.508: IC1.13 88.48,30.48 R19.1 R20.2
N$8
  Top 0.508: R14.2 R22.1 78.32,19.9 IC1.6
N$9
  Top 0.508: R24.2 52.07,93.98 OK3.2
N$10
  Top 0.508: R2.2 41.91,93.98 OK4.2
N$11
  Top 0.508: IC1.12 87.23,28.82 C7.1 91.11,28.82 R21.2
N$12
  Bottom 0.508: F1.1A 11.43,59.69 15.24,63.5 15.24,71.12 J1.3
N$15
  Top 0.508: R23.2 73.69,21.98 C5.1 77.86,21.98 IC1.5
N$17
  Top 0.508: R30.2 72.39,93.98 OK5.2
N$18
  Top 0.508: R29.2 62.23,93.98 OK6.2
N$21
  Top 0.508: R40.2 99.71,59.46 T1.1
N$22
  Top 0.508: T1.2 T1.4 109.22,57.86 K1.2
  Bottom 0.508: K1.2 109.22,66.82 D1.A
N$23
  Top 0.508: T2.1 111.99,18.82 109.22,21.59 109.22,36.83 83.82,62.23 83.82,80.01 86.36,82.55 90.17,82.55 R41.2
N$24
  Top 0.508: T4.1 132.56,19.05 128.27,19.05 127,20.32 127,27.94 134.62,35.56 140.97,35.56 146.05,40.64 146.05,44.45 162.56,60.96 R43.2
N$25
  Top 0.508: T2.2 T2.4 121.92,17.22 K2.2
  Bottom 0.508: K2.2 121.92,26.67 120.65,27.94 D2.A
N$26
  Top 0.508: R42.2 87.63,64.77 100.33,52.07 113.03,52.07 120.42,59.46 T3.1
N$27
  Top 0.508: T3.2 T3.4 | 129.54,57.15 T3.4 | T3.4 129.54,57.86 K3.2
  Bottom 0.508: K3.2 129.54,67.31 128.27,68.58 D3.A
N$28
  Top 0.508: T5.1 144.55,59.46 146.05,60.96 146.05,67.31 161.29,82.55 165.1,82.55 R44.2
N$29
  Top 0.508: T4.2 T4.4 139.7,16.51 K4.2
  Bottom 0.508: K4.2 139.7,26.67 138.43,27.94 D4.A
N$30
  Top 0.508: T6.1 147.55,18.82 144.78,21.59 144.78,29.21 151.13,35.56 160.02,35.56 167.64,41.91 R45.2
N$31
  Top 0.508: T5.2 T5.4 149.86,57.15 K5.2
  Bottom 0.508: K5.2 149.86,67.31 148.59,68.58 D5.A
N$32
  Top 0.508: T6.2 T6.4 157.48,17.22 K6.2
  Bottom 0.508: K6.2 157.48,26.67 156.21,27.94 D6.A
PWM0
  Top 0.508: X11.1 105.41,21.59 106.68,22.86 106.68,31.75 102.87,35.56 72.39,35.56 69.85,33.02 69.85,29.21 70.36,28.7 R15.1
PWM1
  Top 0.508: X11.2 100.33,24.13 95.25,19.05 95.25,16.51 93.98,15.24 72.39,15.24 69.85,17.78 69.85,20.32 71.5,21.97 R23.1
PWM2
  Top 0.508: X11.3 100.33,26.67 95.89,22.23 R18.1
PWM3
  Top 0.508: R21.1 93.69,29.21 X11.4
VCC
  Top 0.508: C2.1 44.05,51.67 45.72,53.34 IC5.2 X4.2 72.39,53.34 78.74,59.69 78.74,82.55 | R32.2 78.32,82.55 78.74,82.55 | 78.74,82.55 78.74,86.36 76.2,88.9 69.85,88.9 | 69.85,88.9 59.69,88.9 | 59.69,88.9 49.53,88.9 | 49.53,88.9 39.37,88.9 | R27.2 49.53,84.24 49.53,88.9 | R26.1 39.37,84.24 39.37,88.9 | R28.2 59.69,84.24 59.69,88.9 | R31.2 69.85,84.24 69.85,88.9 | 39.37,88.9 29.21,88.9 29.21,83.82 26.67,81.28 R25.2
VDD
  Top 0.508: 22.86,49.53 C1.1 | 22.86,49.53 27.94,49.53 IC3.1 34.29,50.8 41.91,43.18 41.91,39.37 | IC4.4 40.64,26.67 41.91,27.94 41.91,39.37 | IC1.4 64.77,25.4 57.15,33.02 57.15,38.1 55.88,39.37 41.91,39.37 | K1.1 101.6,67.31 102.87,68.58 119.38,68.58 121.92,66.04 | 121.92,66.04 K3.1 | 121.92,66.04 124.46,68.58 139.7,68.58 142.24,66.04 K5.1 | F1.2A 12.95,41.91 | 12.95,41.91 20.57,49.53 22.86,49.53 | D11.C 12.95,41.91
  Bottom 0.508: K1.1 101.6,66.82 D1.C | K3.1 121.92,66.82 D3.C | K5.1 142.24,67.31 143.51,68.58 D5.C | K2.1 114.3,26.67 115.57,27.94 D2.C 116.06,29.7 116.84,30.48 | K4.1 132.08,26.67 133.35,27.94 D4.C 133.84,29.7 | K6.1 149.86,26.67 151.13,27.94 D6.C 151.62,29.99 151.13,30.48 134.62,30.48 133.84,29.7 | 100.97,63.5 K1.1 | 116.84,30.48 133.35,30.48 133.84,29.99 133.84,29.7 | 116.84,30.48 96.52,50.8 96.52,59.69 | K1.1 98.42,64.14 96.52,62.23 96.52,59.69 | 96.52,59.69 39.37,59.69 34.29,54.61 34.29,52.07 33.02,50.8 IC3.1

### Text on the board
Top: 0 | 0 | RELAY IN | RELAY OUT | 3 | 0 | 0 | DSTMIN | DSTMIN | VCC | GND | ADC | 0 | ANALOG IN | ANALOG OUT | 0 | 0 | PRACA DYPLOMOWA / MAGISTERSKA | WOJCIECH / SKWIERAWSKI | REPOS: / github.com\WojSkwie
tNames: H | M